# Altium schematic sheet mantarray_beta2_sensor.SchDoc
size A1
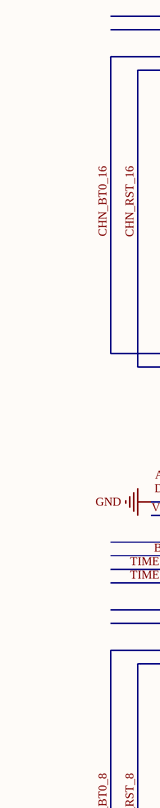
[diagram p0: mantarray_beta2_sensor.SchDoc, top left]
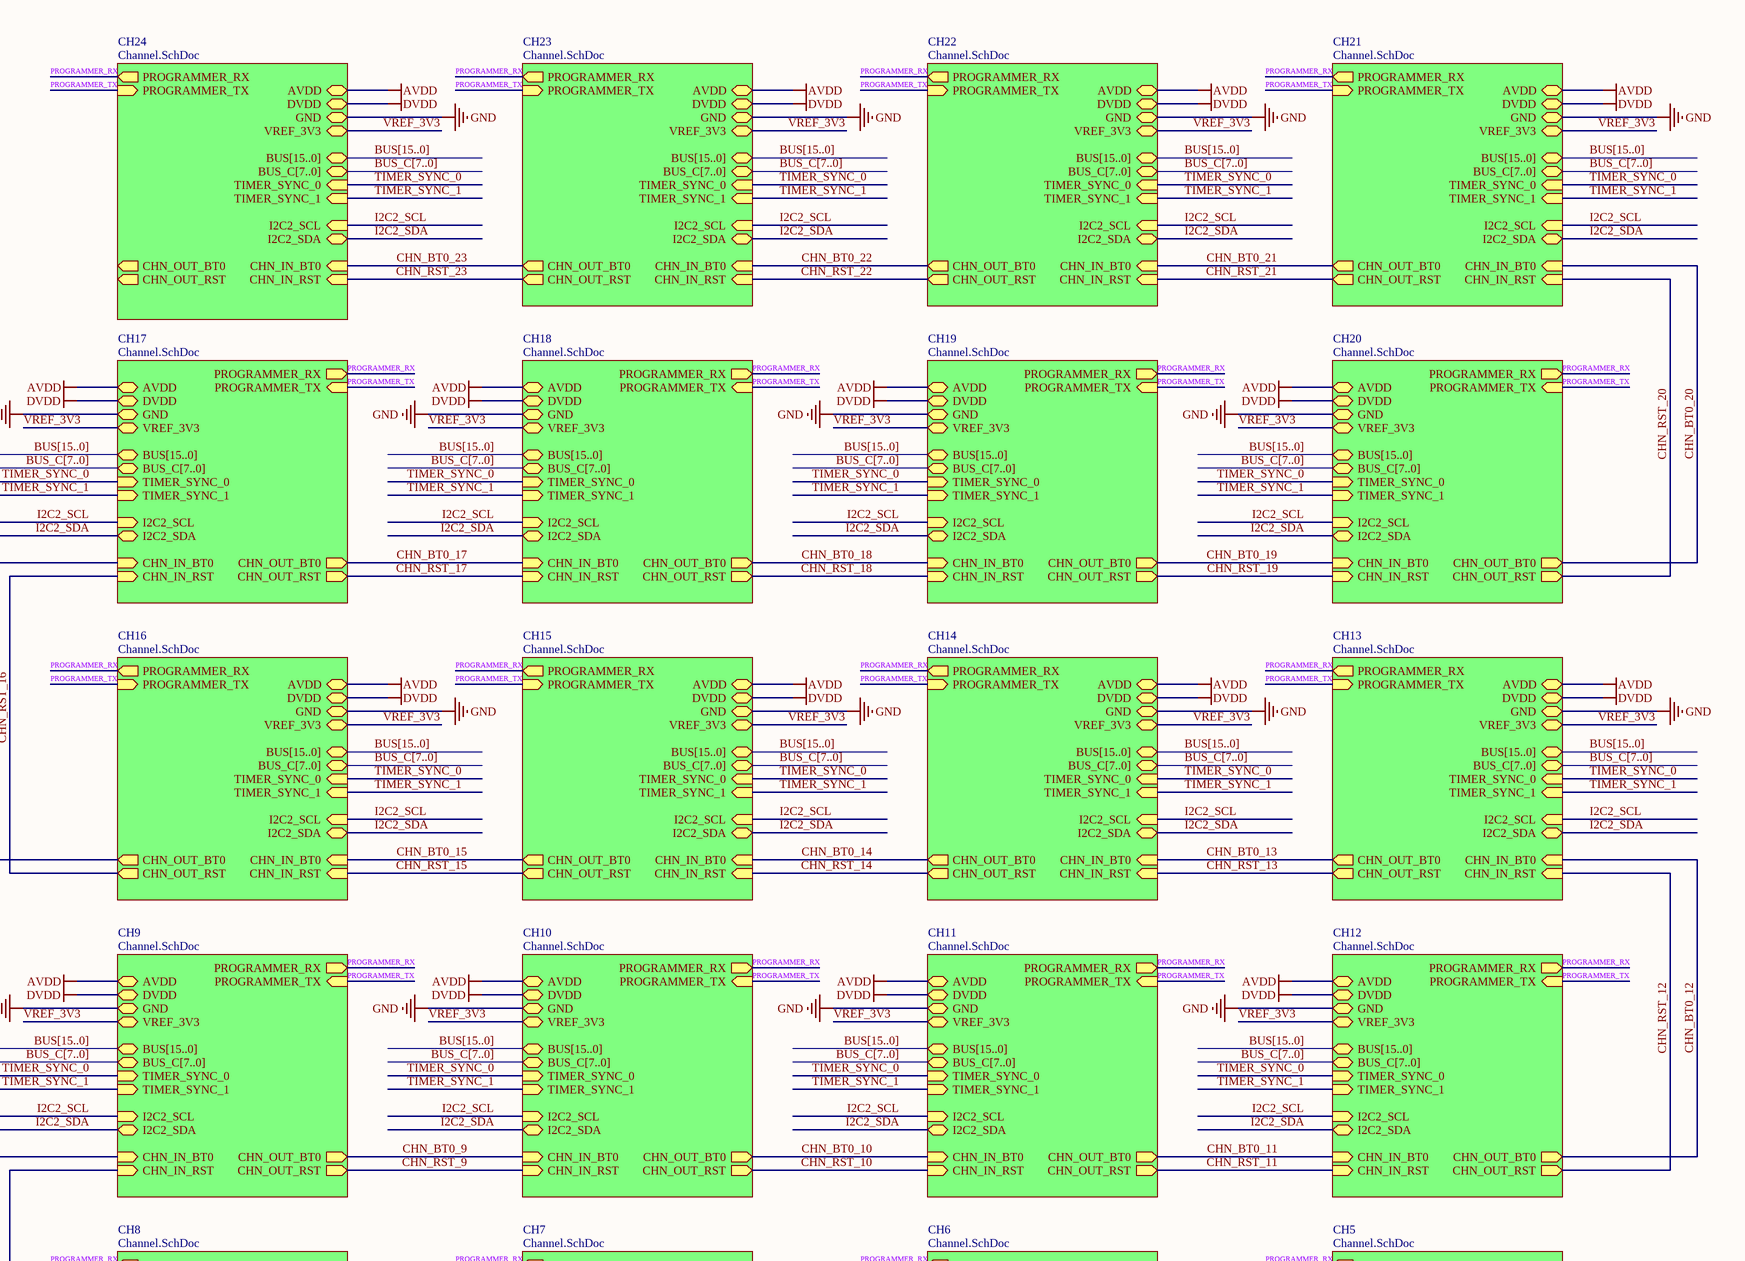
[diagram p1: mantarray_beta2_sensor.SchDoc, top right]
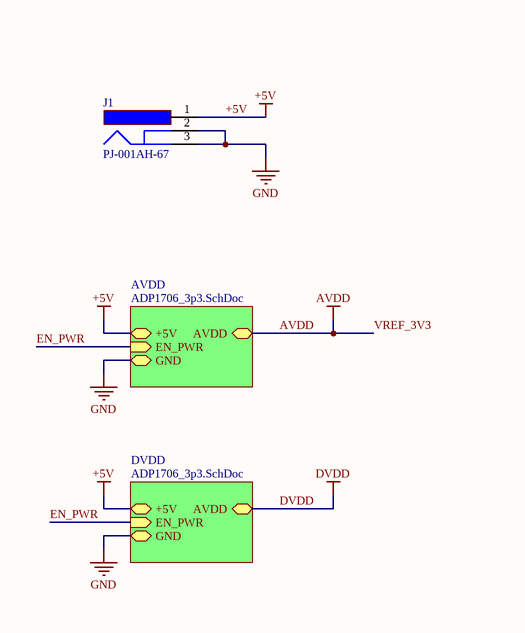
[diagram p2: mantarray_beta2_sensor.SchDoc, bottom left]
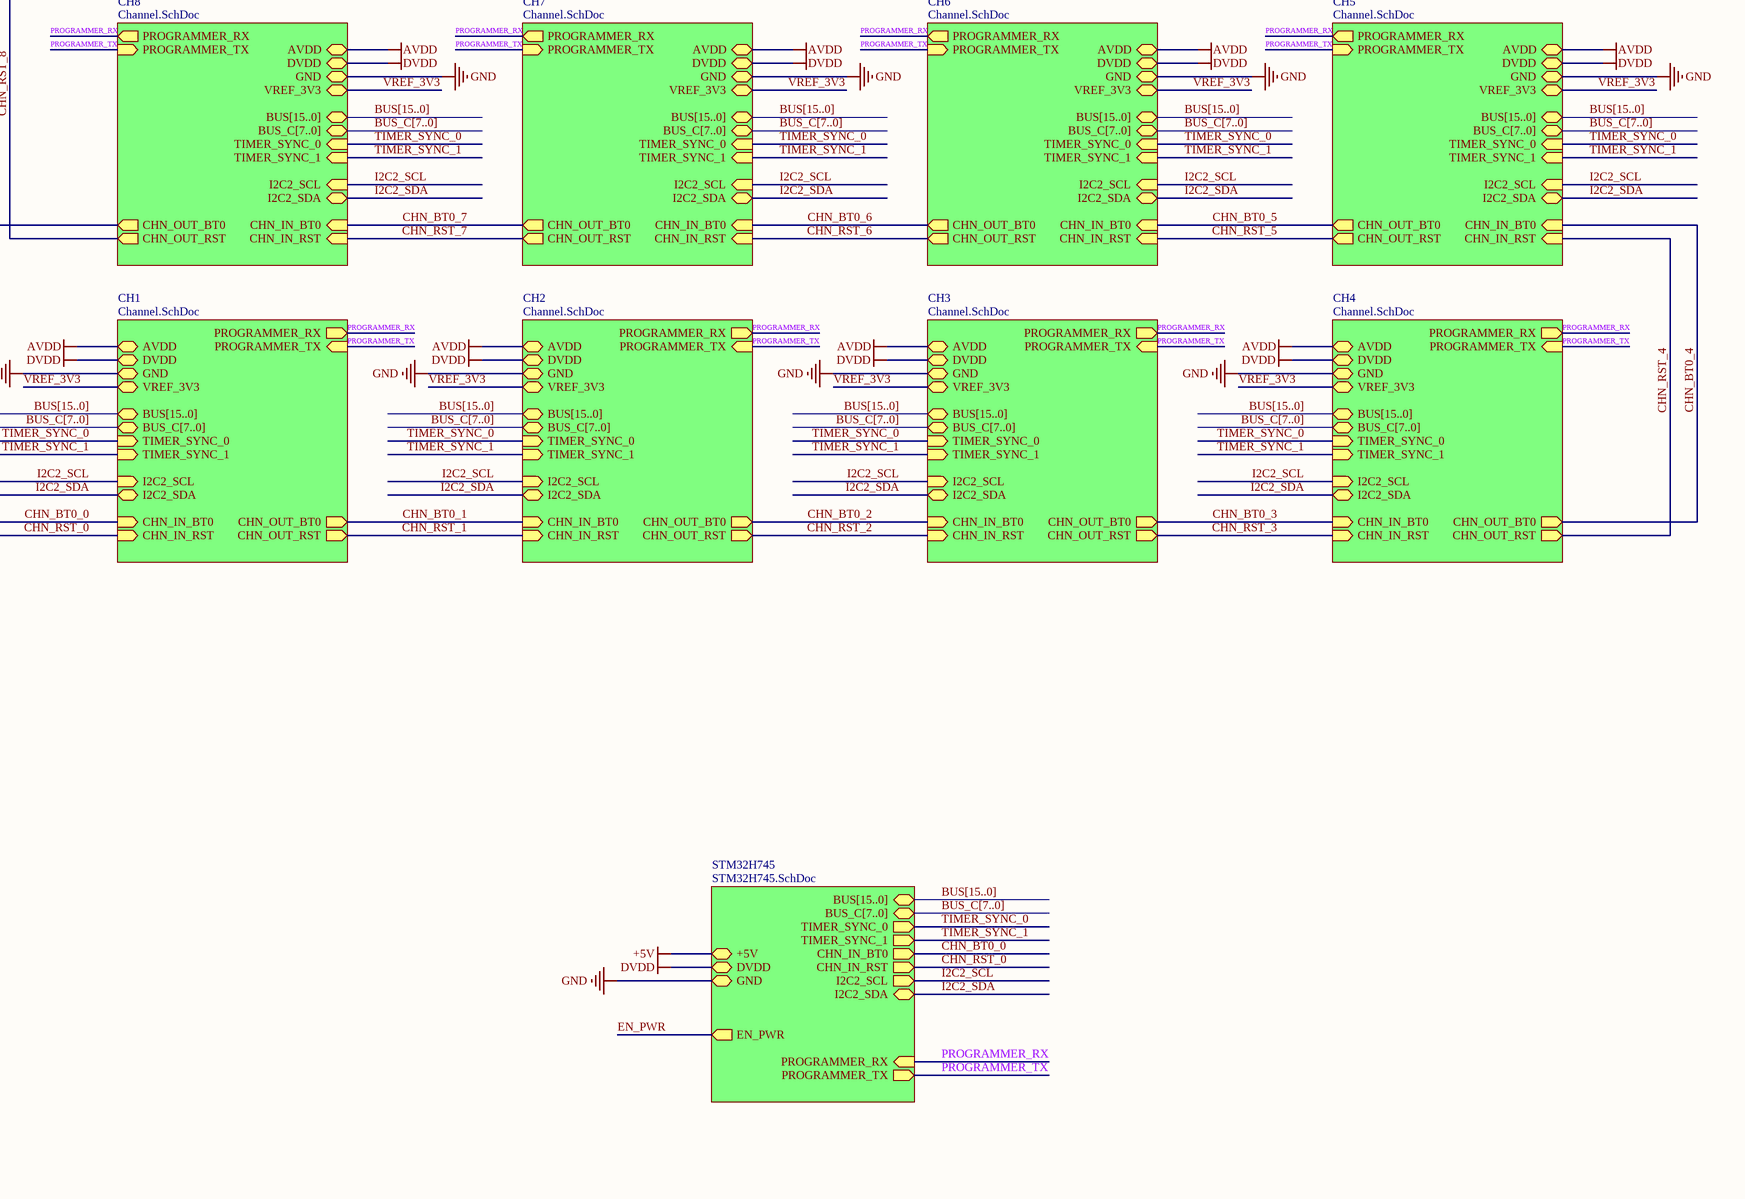
[diagram p3: mantarray_beta2_sensor.SchDoc, bottom right]

## Parts
J1  PJ-001AH-67  [PJ-001AH-67]

## Sub-sheets
AVDD = ADP1706_3p3.SchDoc: GND (bidir), AVDD (bidir), +5V (bidir), EN_PWR (in)
CH1 = Channel.SchDoc: AVDD (bidir), DVDD (bidir), GND (bidir), BUS[15..0] (bidir), CHN_OUT_BT0 (out), CHN_OUT_RST (out), BUS_C[7..0] (bidir), VREF_3V3 (bidir), CHN_IN_RST (in), TIMER_SYNC_0 (in), CHN_IN_BT0 (in), TIMER_SYNC_1 (in), I2C2_SCL (in), I2C2_SDA (bidir), PROGRAMMER_RX (out), PROGRAMMER_TX (in)
CH2 = Channel.SchDoc: AVDD (bidir), DVDD (bidir), GND (bidir), BUS[15..0] (bidir), CHN_OUT_BT0 (out), CHN_OUT_RST (out), BUS_C[7..0] (bidir), VREF_3V3 (bidir), CHN_IN_RST (in), TIMER_SYNC_0 (in), CHN_IN_BT0 (in), TIMER_SYNC_1 (in), I2C2_SCL (in), I2C2_SDA (bidir), PROGRAMMER_RX (out), PROGRAMMER_TX (in)
CH3 = Channel.SchDoc: AVDD (bidir), DVDD (bidir), GND (bidir), BUS[15..0] (bidir), CHN_OUT_BT0 (out), CHN_OUT_RST (out), BUS_C[7..0] (bidir), VREF_3V3 (bidir), CHN_IN_RST (in), TIMER_SYNC_0 (in), CHN_IN_BT0 (in), TIMER_SYNC_1 (in), I2C2_SCL (in), I2C2_SDA (bidir), PROGRAMMER_RX (out), PROGRAMMER_TX (in)
CH4 = Channel.SchDoc: AVDD (bidir), DVDD (bidir), GND (bidir), BUS[15..0] (bidir), CHN_OUT_BT0 (out), CHN_OUT_RST (out), BUS_C[7..0] (bidir), VREF_3V3 (bidir), CHN_IN_RST (in), TIMER_SYNC_0 (in), CHN_IN_BT0 (in), TIMER_SYNC_1 (in), I2C2_SCL (in), I2C2_SDA (bidir), PROGRAMMER_RX (out), PROGRAMMER_TX (in)
CH5 = Channel.SchDoc: AVDD (bidir), DVDD (bidir), GND (bidir), BUS[15..0] (bidir), CHN_OUT_BT0 (out), CHN_OUT_RST (out), BUS_C[7..0] (bidir), VREF_3V3 (bidir), CHN_IN_RST (in), TIMER_SYNC_0 (in), CHN_IN_BT0 (in), TIMER_SYNC_1 (in), I2C2_SCL (in), I2C2_SDA (bidir), PROGRAMMER_TX (in), PROGRAMMER_RX (out)
CH6 = Channel.SchDoc: AVDD (bidir), DVDD (bidir), GND (bidir), BUS[15..0] (bidir), CHN_OUT_BT0 (out), CHN_OUT_RST (out), BUS_C[7..0] (bidir), VREF_3V3 (bidir), CHN_IN_RST (in), TIMER_SYNC_0 (in), CHN_IN_BT0 (in), TIMER_SYNC_1 (in), I2C2_SCL (in), I2C2_SDA (bidir), PROGRAMMER_RX (out), PROGRAMMER_TX (in)
CH7 = Channel.SchDoc: AVDD (bidir), DVDD (bidir), GND (bidir), BUS[15..0] (bidir), CHN_OUT_BT0 (out), CHN_OUT_RST (out), BUS_C[7..0] (bidir), VREF_3V3 (bidir), CHN_IN_RST (in), TIMER_SYNC_0 (in), CHN_IN_BT0 (in), TIMER_SYNC_1 (in), I2C2_SCL (in), I2C2_SDA (bidir), PROGRAMMER_RX (out), PROGRAMMER_TX (in)
CH8 = Channel.SchDoc: AVDD (bidir), DVDD (bidir), GND (bidir), BUS[15..0] (bidir), CHN_OUT_BT0 (out), CHN_OUT_RST (out), BUS_C[7..0] (bidir), VREF_3V3 (bidir), CHN_IN_RST (in), TIMER_SYNC_0 (in), CHN_IN_BT0 (in), TIMER_SYNC_1 (in), I2C2_SCL (in), I2C2_SDA (bidir), PROGRAMMER_RX (out), PROGRAMMER_TX (in)
CH9 = Channel.SchDoc: AVDD (bidir), DVDD (bidir), GND (bidir), BUS[15..0] (bidir), CHN_OUT_BT0 (out), CHN_OUT_RST (out), BUS_C[7..0] (bidir), VREF_3V3 (bidir), CHN_IN_RST (in), TIMER_SYNC_0 (in), CHN_IN_BT0 (in), TIMER_SYNC_1 (in), I2C2_SCL (in), I2C2_SDA (bidir), PROGRAMMER_RX (out), PROGRAMMER_TX (in)
CH10 = Channel.SchDoc: AVDD (bidir), DVDD (bidir), GND (bidir), BUS[15..0] (bidir), CHN_OUT_BT0 (out), CHN_OUT_RST (out), BUS_C[7..0] (bidir), VREF_3V3 (bidir), CHN_IN_RST (in), TIMER_SYNC_0 (in), CHN_IN_BT0 (in), TIMER_SYNC_1 (in), I2C2_SCL (in), I2C2_SDA (bidir), PROGRAMMER_TX (in), PROGRAMMER_RX (out)
CH11 = Channel.SchDoc: AVDD (bidir), DVDD (bidir), GND (bidir), BUS[15..0] (bidir), CHN_OUT_BT0 (out), CHN_OUT_RST (out), BUS_C[7..0] (bidir), VREF_3V3 (bidir), CHN_IN_RST (in), TIMER_SYNC_0 (in), CHN_IN_BT0 (in), TIMER_SYNC_1 (in), I2C2_SCL (in), I2C2_SDA (bidir), PROGRAMMER_RX (out), PROGRAMMER_TX (in)
CH12 = Channel.SchDoc: AVDD (bidir), DVDD (bidir), GND (bidir), BUS[15..0] (bidir), CHN_OUT_BT0 (out), CHN_OUT_RST (out), BUS_C[7..0] (bidir), VREF_3V3 (bidir), CHN_IN_RST (in), TIMER_SYNC_0 (in), CHN_IN_BT0 (in), TIMER_SYNC_1 (in), I2C2_SCL (in), I2C2_SDA (bidir), PROGRAMMER_TX (in), PROGRAMMER_RX (out)
CH13 = Channel.SchDoc: AVDD (bidir), DVDD (bidir), GND (bidir), BUS[15..0] (bidir), CHN_OUT_BT0 (out), CHN_OUT_RST (out), BUS_C[7..0] (bidir), VREF_3V3 (bidir), CHN_IN_RST (in), TIMER_SYNC_0 (in), CHN_IN_BT0 (in), TIMER_SYNC_1 (in), I2C2_SCL (in), I2C2_SDA (bidir), PROGRAMMER_RX (out), PROGRAMMER_TX (in)
CH14 = Channel.SchDoc: AVDD (bidir), DVDD (bidir), GND (bidir), BUS[15..0] (bidir), CHN_OUT_BT0 (out), CHN_OUT_RST (out), BUS_C[7..0] (bidir), VREF_3V3 (bidir), CHN_IN_RST (in), TIMER_SYNC_0 (in), CHN_IN_BT0 (in), TIMER_SYNC_1 (in), I2C2_SCL (in), I2C2_SDA (bidir), PROGRAMMER_RX (out), PROGRAMMER_TX (in)
CH15 = Channel.SchDoc: AVDD (bidir), DVDD (bidir), GND (bidir), BUS[15..0] (bidir), CHN_OUT_BT0 (out), CHN_OUT_RST (out), BUS_C[7..0] (bidir), VREF_3V3 (bidir), CHN_IN_RST (in), TIMER_SYNC_0 (in), CHN_IN_BT0 (in), TIMER_SYNC_1 (in), I2C2_SCL (in), I2C2_SDA (bidir), PROGRAMMER_RX (out), PROGRAMMER_TX (in)
CH16 = Channel.SchDoc: AVDD (bidir), DVDD (bidir), GND (bidir), BUS[15..0] (bidir), CHN_OUT_BT0 (out), CHN_OUT_RST (out), BUS_C[7..0] (bidir), VREF_3V3 (bidir), CHN_IN_RST (in), TIMER_SYNC_0 (in), CHN_IN_BT0 (in), TIMER_SYNC_1 (in), I2C2_SCL (in), I2C2_SDA (bidir), PROGRAMMER_TX (in), PROGRAMMER_RX (out)
CH17 = Channel.SchDoc: AVDD (bidir), DVDD (bidir), GND (bidir), BUS[15..0] (bidir), CHN_OUT_BT0 (out), CHN_OUT_RST (out), BUS_C[7..0] (bidir), VREF_3V3 (bidir), CHN_IN_RST (in), TIMER_SYNC_0 (in), CHN_IN_BT0 (in), TIMER_SYNC_1 (in), I2C2_SCL (in), I2C2_SDA (bidir), PROGRAMMER_TX (in), PROGRAMMER_RX (out)
CH18 = Channel.SchDoc: AVDD (bidir), DVDD (bidir), GND (bidir), BUS[15..0] (bidir), CHN_OUT_BT0 (out), CHN_OUT_RST (out), BUS_C[7..0] (bidir), VREF_3V3 (bidir), CHN_IN_RST (in), TIMER_SYNC_0 (in), CHN_IN_BT0 (in), TIMER_SYNC_1 (in), I2C2_SCL (in), I2C2_SDA (bidir), PROGRAMMER_RX (out), PROGRAMMER_TX (in)
CH19 = Channel.SchDoc: AVDD (bidir), DVDD (bidir), GND (bidir), BUS[15..0] (bidir), CHN_OUT_BT0 (out), CHN_OUT_RST (out), BUS_C[7..0] (bidir), VREF_3V3 (bidir), CHN_IN_RST (in), TIMER_SYNC_0 (in), CHN_IN_BT0 (in), TIMER_SYNC_1 (in), I2C2_SCL (in), I2C2_SDA (bidir), PROGRAMMER_TX (in), PROGRAMMER_RX (out)
CH20 = Channel.SchDoc: AVDD (bidir), DVDD (bidir), GND (bidir), BUS[15..0] (bidir), CHN_OUT_BT0 (out), CHN_OUT_RST (out), BUS_C[7..0] (bidir), VREF_3V3 (bidir), CHN_IN_RST (in), TIMER_SYNC_0 (in), CHN_IN_BT0 (in), TIMER_SYNC_1 (in), I2C2_SCL (in), I2C2_SDA (bidir), PROGRAMMER_RX (out), PROGRAMMER_TX (in)
CH21 = Channel.SchDoc: AVDD (bidir), DVDD (bidir), GND (bidir), BUS[15..0] (bidir), CHN_OUT_BT0 (out), CHN_OUT_RST (out), BUS_C[7..0] (bidir), VREF_3V3 (bidir), CHN_IN_RST (in), TIMER_SYNC_0 (in), CHN_IN_BT0 (in), TIMER_SYNC_1 (in), I2C2_SCL (in), I2C2_SDA (bidir), PROGRAMMER_TX (in), PROGRAMMER_RX (out)
CH22 = Channel.SchDoc: AVDD (bidir), DVDD (bidir), GND (bidir), BUS[15..0] (bidir), CHN_OUT_BT0 (out), CHN_OUT_RST (out), BUS_C[7..0] (bidir), VREF_3V3 (bidir), CHN_IN_RST (in), TIMER_SYNC_0 (in), CHN_IN_BT0 (in), TIMER_SYNC_1 (in), I2C2_SCL (in), I2C2_SDA (bidir), PROGRAMMER_TX (in), PROGRAMMER_RX (out)
CH23 = Channel.SchDoc: AVDD (bidir), DVDD (bidir), GND (bidir), BUS[15..0] (bidir), CHN_OUT_BT0 (out), CHN_OUT_RST (out), BUS_C[7..0] (bidir), VREF_3V3 (bidir), CHN_IN_RST (in), TIMER_SYNC_0 (in), CHN_IN_BT0 (in), TIMER_SYNC_1 (in), I2C2_SCL (in), I2C2_SDA (bidir), PROGRAMMER_RX (out), PROGRAMMER_TX (in)
CH24 = Channel.SchDoc: AVDD (bidir), DVDD (bidir), GND (bidir), BUS[15..0] (bidir), CHN_OUT_BT0 (out), CHN_OUT_RST (out), BUS_C[7..0] (bidir), VREF_3V3 (bidir), CHN_IN_RST (in), TIMER_SYNC_0 (in), CHN_IN_BT0 (in), TIMER_SYNC_1 (in), I2C2_SCL (in), I2C2_SDA (bidir), PROGRAMMER_RX (out), PROGRAMMER_TX (in)
DVDD = ADP1706_3p3.SchDoc: GND (bidir), AVDD (bidir), +5V (bidir), EN_PWR (in)
STM32H745 = STM32H745.SchDoc: GND (bidir), DVDD (bidir), +5V (bidir), BUS[15..0] (bidir), BUS_C[7..0] (bidir), TIMER_SYNC_0 (out), I2C2_SDA (bidir), I2C2_SCL (out), TIMER_SYNC_1 (out), CHN_IN_BT0 (out), CHN_IN_RST (out), PROGRAMMER_RX (in), PROGRAMMER_TX (out), EN_PWR (out)

## Nets
+5V: J1.1 ; sheet AVDD/+5V, sheet DVDD/+5V, sheet STM32H745/+5V
AVDD: sheet AVDD/AVDD, sheet CH1/AVDD, sheet CH1/VREF_3V3, sheet CH2/AVDD, sheet CH2/VREF_3V3, sheet CH3/AVDD, sheet CH3/VREF_3V3, sheet CH4/AVDD, sheet CH4/VREF_3V3, sheet CH5/AVDD, sheet CH5/VREF_3V3, sheet CH6/AVDD, sheet CH6/VREF_3V3, sheet CH7/AVDD, sheet CH7/VREF_3V3, sheet CH8/AVDD, sheet CH8/VREF_3V3, sheet CH9/AVDD, sheet CH9/VREF_3V3, sheet CH10/AVDD, sheet CH10/VREF_3V3, sheet CH11/AVDD, sheet CH11/VREF_3V3, sheet CH12/AVDD, sheet CH12/VREF_3V3, sheet CH13/AVDD, sheet CH13/VREF_3V3, sheet CH14/AVDD, sheet CH14/VREF_3V3, sheet CH15/AVDD, sheet CH15/VREF_3V3, sheet CH16/AVDD, sheet CH16/VREF_3V3, sheet CH17/AVDD, sheet CH17/VREF_3V3, sheet CH18/AVDD, sheet CH18/VREF_3V3, sheet CH19/AVDD, sheet CH19/VREF_3V3, sheet CH20/AVDD, sheet CH20/VREF_3V3, sheet CH21/AVDD, sheet CH21/VREF_3V3, sheet CH22/AVDD, sheet CH22/VREF_3V3, sheet CH23/AVDD, sheet CH23/VREF_3V3, sheet CH24/AVDD, sheet CH24/VREF_3V3  [also labelled VREF_3V3]
DVDD: sheet DVDD/AVDD, sheet STM32H745/DVDD, sheet CH1/DVDD, sheet CH2/DVDD, sheet CH3/DVDD, sheet CH4/DVDD, sheet CH5/DVDD, sheet CH6/DVDD, sheet CH7/DVDD, sheet CH8/DVDD, sheet CH9/DVDD, sheet CH10/DVDD, sheet CH11/DVDD, sheet CH12/DVDD, sheet CH13/DVDD, sheet CH14/DVDD, sheet CH15/DVDD, sheet CH16/DVDD, sheet CH17/DVDD, sheet CH18/DVDD, sheet CH19/DVDD, sheet CH20/DVDD, sheet CH21/DVDD, sheet CH22/DVDD, sheet CH23/DVDD, sheet CH24/DVDD
GND: J1.2 J1.3 ; sheet AVDD/GND, sheet DVDD/GND, sheet STM32H745/GND, sheet CH1/GND, sheet CH2/GND, sheet CH3/GND, sheet CH4/GND, sheet CH5/GND, sheet CH6/GND, sheet CH7/GND, sheet CH8/GND, sheet CH9/GND, sheet CH10/GND, sheet CH11/GND, sheet CH12/GND, sheet CH13/GND, sheet CH14/GND, sheet CH15/GND, sheet CH16/GND, sheet CH17/GND, sheet CH18/GND, sheet CH19/GND, sheet CH20/GND, sheet CH21/GND, sheet CH22/GND, sheet CH23/GND, sheet CH24/GND
CHN_BT0_0: sheet STM32H745/CHN_IN_BT0, sheet CH1/CHN_IN_BT0
CHN_BT0_1: sheet CH1/CHN_OUT_BT0, sheet CH2/CHN_IN_BT0
CHN_BT0_2: sheet CH2/CHN_OUT_BT0, sheet CH3/CHN_IN_BT0
CHN_BT0_3: sheet CH3/CHN_OUT_BT0, sheet CH4/CHN_IN_BT0
CHN_BT0_4: sheet CH4/CHN_OUT_BT0, sheet CH5/CHN_IN_BT0
CHN_BT0_5: sheet CH5/CHN_OUT_BT0, sheet CH6/CHN_IN_BT0
CHN_BT0_6: sheet CH6/CHN_OUT_BT0, sheet CH7/CHN_IN_BT0
CHN_BT0_7: sheet CH7/CHN_OUT_BT0, sheet CH8/CHN_IN_BT0
CHN_BT0_8: sheet CH8/CHN_OUT_BT0, sheet CH9/CHN_IN_BT0
CHN_BT0_9: sheet CH9/CHN_OUT_BT0, sheet CH10/CHN_IN_BT0
CHN_BT0_10: sheet CH10/CHN_OUT_BT0, sheet CH11/CHN_IN_BT0
CHN_BT0_11: sheet CH11/CHN_OUT_BT0, sheet CH12/CHN_IN_BT0
CHN_BT0_12: sheet CH12/CHN_OUT_BT0, sheet CH13/CHN_IN_BT0
CHN_BT0_13: sheet CH13/CHN_OUT_BT0, sheet CH14/CHN_IN_BT0
CHN_BT0_14: sheet CH14/CHN_OUT_BT0, sheet CH15/CHN_IN_BT0
CHN_BT0_15: sheet CH15/CHN_OUT_BT0, sheet CH16/CHN_IN_BT0
CHN_BT0_16: sheet CH16/CHN_OUT_BT0, sheet CH17/CHN_IN_BT0
CHN_BT0_17: sheet CH17/CHN_OUT_BT0, sheet CH18/CHN_IN_BT0
CHN_BT0_18: sheet CH18/CHN_OUT_BT0, sheet CH19/CHN_IN_BT0
CHN_BT0_19: sheet CH19/CHN_OUT_BT0, sheet CH20/CHN_IN_BT0
CHN_BT0_20: sheet CH20/CHN_OUT_BT0, sheet CH21/CHN_IN_BT0
CHN_BT0_21: sheet CH21/CHN_OUT_BT0, sheet CH22/CHN_IN_BT0
CHN_BT0_22: sheet CH22/CHN_OUT_BT0, sheet CH23/CHN_IN_BT0
CHN_BT0_23: sheet CH23/CHN_OUT_BT0, sheet CH24/CHN_IN_BT0
CHN_RST_0: sheet STM32H745/CHN_IN_RST, sheet CH1/CHN_IN_RST
CHN_RST_1: sheet CH1/CHN_OUT_RST, sheet CH2/CHN_IN_RST
CHN_RST_2: sheet CH2/CHN_OUT_RST, sheet CH3/CHN_IN_RST
CHN_RST_3: sheet CH3/CHN_OUT_RST, sheet CH4/CHN_IN_RST
CHN_RST_4: sheet CH4/CHN_OUT_RST, sheet CH5/CHN_IN_RST
CHN_RST_5: sheet CH5/CHN_OUT_RST, sheet CH6/CHN_IN_RST
CHN_RST_6: sheet CH6/CHN_OUT_RST, sheet CH7/CHN_IN_RST
CHN_RST_7: sheet CH7/CHN_OUT_RST, sheet CH8/CHN_IN_RST
CHN_RST_8: sheet CH8/CHN_OUT_RST, sheet CH9/CHN_IN_RST
CHN_RST_9: sheet CH9/CHN_OUT_RST, sheet CH10/CHN_IN_RST
CHN_RST_10: sheet CH10/CHN_OUT_RST, sheet CH11/CHN_IN_RST
CHN_RST_11: sheet CH11/CHN_OUT_RST, sheet CH12/CHN_IN_RST
CHN_RST_12: sheet CH12/CHN_OUT_RST, sheet CH13/CHN_IN_RST
CHN_RST_13: sheet CH13/CHN_OUT_RST, sheet CH14/CHN_IN_RST
CHN_RST_14: sheet CH14/CHN_OUT_RST, sheet CH15/CHN_IN_RST
CHN_RST_15: sheet CH15/CHN_OUT_RST, sheet CH16/CHN_IN_RST
CHN_RST_16: sheet CH16/CHN_OUT_RST, sheet CH17/CHN_IN_RST
CHN_RST_17: sheet CH17/CHN_OUT_RST, sheet CH18/CHN_IN_RST
CHN_RST_18: sheet CH18/CHN_OUT_RST, sheet CH19/CHN_IN_RST
CHN_RST_19: sheet CH19/CHN_OUT_RST, sheet CH20/CHN_IN_RST
CHN_RST_20: sheet CH20/CHN_OUT_RST, sheet CH21/CHN_IN_RST
CHN_RST_21: sheet CH21/CHN_OUT_RST, sheet CH22/CHN_IN_RST
CHN_RST_22: sheet CH22/CHN_OUT_RST, sheet CH23/CHN_IN_RST
CHN_RST_23: sheet CH23/CHN_OUT_RST, sheet CH24/CHN_IN_RST
EN_PWR: sheet AVDD/EN_PWR, sheet DVDD/EN_PWR, sheet STM32H745/EN_PWR
I2C2_SCL: sheet STM32H745/I2C2_SCL, sheet CH1/I2C2_SCL, sheet CH2/I2C2_SCL, sheet CH3/I2C2_SCL, sheet CH4/I2C2_SCL, sheet CH5/I2C2_SCL, sheet CH6/I2C2_SCL, sheet CH7/I2C2_SCL, sheet CH8/I2C2_SCL, sheet CH9/I2C2_SCL, sheet CH10/I2C2_SCL, sheet CH11/I2C2_SCL, sheet CH12/I2C2_SCL, sheet CH13/I2C2_SCL, sheet CH14/I2C2_SCL, sheet CH15/I2C2_SCL, sheet CH16/I2C2_SCL, sheet CH17/I2C2_SCL, sheet CH18/I2C2_SCL, sheet CH19/I2C2_SCL, sheet CH20/I2C2_SCL, sheet CH21/I2C2_SCL, sheet CH22/I2C2_SCL, sheet CH23/I2C2_SCL, sheet CH24/I2C2_SCL
I2C2_SDA: sheet STM32H745/I2C2_SDA, sheet CH1/I2C2_SDA, sheet CH2/I2C2_SDA, sheet CH3/I2C2_SDA, sheet CH4/I2C2_SDA, sheet CH5/I2C2_SDA, sheet CH6/I2C2_SDA, sheet CH7/I2C2_SDA, sheet CH8/I2C2_SDA, sheet CH9/I2C2_SDA, sheet CH10/I2C2_SDA, sheet CH11/I2C2_SDA, sheet CH12/I2C2_SDA, sheet CH13/I2C2_SDA, sheet CH14/I2C2_SDA, sheet CH15/I2C2_SDA, sheet CH16/I2C2_SDA, sheet CH17/I2C2_SDA, sheet CH18/I2C2_SDA, sheet CH19/I2C2_SDA, sheet CH20/I2C2_SDA, sheet CH21/I2C2_SDA, sheet CH22/I2C2_SDA, sheet CH23/I2C2_SDA, sheet CH24/I2C2_SDA
PROGRAMMER_RX: sheet STM32H745/PROGRAMMER_RX, sheet CH1/PROGRAMMER_RX, sheet CH2/PROGRAMMER_RX, sheet CH3/PROGRAMMER_RX, sheet CH4/PROGRAMMER_RX, sheet CH5/PROGRAMMER_RX, sheet CH6/PROGRAMMER_RX, sheet CH7/PROGRAMMER_RX, sheet CH8/PROGRAMMER_RX, sheet CH9/PROGRAMMER_RX, sheet CH10/PROGRAMMER_RX, sheet CH11/PROGRAMMER_RX, sheet CH12/PROGRAMMER_RX, sheet CH13/PROGRAMMER_RX, sheet CH14/PROGRAMMER_RX, sheet CH15/PROGRAMMER_RX, sheet CH16/PROGRAMMER_RX, sheet CH17/PROGRAMMER_RX, sheet CH18/PROGRAMMER_RX, sheet CH19/PROGRAMMER_RX, sheet CH20/PROGRAMMER_RX, sheet CH21/PROGRAMMER_RX, sheet CH22/PROGRAMMER_RX, sheet CH23/PROGRAMMER_RX, sheet CH24/PROGRAMMER_RX
PROGRAMMER_TX: sheet STM32H745/PROGRAMMER_TX, sheet CH1/PROGRAMMER_TX, sheet CH2/PROGRAMMER_TX, sheet CH3/PROGRAMMER_TX, sheet CH4/PROGRAMMER_TX, sheet CH5/PROGRAMMER_TX, sheet CH6/PROGRAMMER_TX, sheet CH7/PROGRAMMER_TX, sheet CH8/PROGRAMMER_TX, sheet CH9/PROGRAMMER_TX, sheet CH10/PROGRAMMER_TX, sheet CH11/PROGRAMMER_TX, sheet CH12/PROGRAMMER_TX, sheet CH13/PROGRAMMER_TX, sheet CH14/PROGRAMMER_TX, sheet CH15/PROGRAMMER_TX, sheet CH16/PROGRAMMER_TX, sheet CH17/PROGRAMMER_TX, sheet CH18/PROGRAMMER_TX, sheet CH19/PROGRAMMER_TX, sheet CH20/PROGRAMMER_TX, sheet CH21/PROGRAMMER_TX, sheet CH22/PROGRAMMER_TX, sheet CH23/PROGRAMMER_TX, sheet CH24/PROGRAMMER_TX
TIMER_SYNC_0: sheet STM32H745/TIMER_SYNC_0, sheet CH1/TIMER_SYNC_0, sheet CH2/TIMER_SYNC_0, sheet CH3/TIMER_SYNC_0, sheet CH4/TIMER_SYNC_0, sheet CH5/TIMER_SYNC_0, sheet CH6/TIMER_SYNC_0, sheet CH7/TIMER_SYNC_0, sheet CH8/TIMER_SYNC_0, sheet CH9/TIMER_SYNC_0, sheet CH10/TIMER_SYNC_0, sheet CH11/TIMER_SYNC_0, sheet CH12/TIMER_SYNC_0, sheet CH13/TIMER_SYNC_0, sheet CH14/TIMER_SYNC_0, sheet CH15/TIMER_SYNC_0, sheet CH16/TIMER_SYNC_0, sheet CH17/TIMER_SYNC_0, sheet CH18/TIMER_SYNC_0, sheet CH19/TIMER_SYNC_0, sheet CH20/TIMER_SYNC_0, sheet CH21/TIMER_SYNC_0, sheet CH22/TIMER_SYNC_0, sheet CH23/TIMER_SYNC_0, sheet CH24/TIMER_SYNC_0
TIMER_SYNC_1: sheet STM32H745/TIMER_SYNC_1, sheet CH1/TIMER_SYNC_1, sheet CH2/TIMER_SYNC_1, sheet CH3/TIMER_SYNC_1, sheet CH4/TIMER_SYNC_1, sheet CH5/TIMER_SYNC_1, sheet CH6/TIMER_SYNC_1, sheet CH7/TIMER_SYNC_1, sheet CH8/TIMER_SYNC_1, sheet CH9/TIMER_SYNC_1, sheet CH10/TIMER_SYNC_1, sheet CH11/TIMER_SYNC_1, sheet CH12/TIMER_SYNC_1, sheet CH13/TIMER_SYNC_1, sheet CH14/TIMER_SYNC_1, sheet CH15/TIMER_SYNC_1, sheet CH16/TIMER_SYNC_1, sheet CH17/TIMER_SYNC_1, sheet CH18/TIMER_SYNC_1, sheet CH19/TIMER_SYNC_1, sheet CH20/TIMER_SYNC_1, sheet CH21/TIMER_SYNC_1, sheet CH22/TIMER_SYNC_1, sheet CH23/TIMER_SYNC_1, sheet CH24/TIMER_SYNC_1

## Buses and harness runs
bus BUS[15..0] = sheet CH1/BUS[15..0]
bus BUS[15..0] = sheet CH2/BUS[15..0]
bus BUS[15..0] = sheet CH3/BUS[15..0]
bus BUS[15..0] = sheet CH4/BUS[15..0]
bus BUS[15..0] = sheet CH5/BUS[15..0]
bus BUS[15..0] = sheet CH6/BUS[15..0]
bus BUS[15..0] = sheet CH7/BUS[15..0]
bus BUS[15..0] = sheet CH8/BUS[15..0]
bus BUS[15..0] = sheet CH9/BUS[15..0]
bus BUS[15..0] = sheet CH10/BUS[15..0]
bus BUS[15..0] = sheet CH11/BUS[15..0]
bus BUS[15..0] = sheet CH12/BUS[15..0]
bus BUS[15..0] = sheet CH13/BUS[15..0]
bus BUS[15..0] = sheet CH14/BUS[15..0]
bus BUS[15..0] = sheet CH15/BUS[15..0]
bus BUS[15..0] = sheet CH16/BUS[15..0]
bus BUS[15..0] = sheet CH17/BUS[15..0]
bus BUS[15..0] = sheet CH18/BUS[15..0]
bus BUS[15..0] = sheet CH19/BUS[15..0]
bus BUS[15..0] = sheet CH20/BUS[15..0]
bus BUS[15..0] = sheet CH21/BUS[15..0]
bus BUS[15..0] = sheet CH22/BUS[15..0]
bus BUS[15..0] = sheet CH23/BUS[15..0]
bus BUS[15..0] = sheet CH24/BUS[15..0]
bus BUS[15..0] = sheet STM32H745/BUS[15..0]
bus BUS_C[7..0] = sheet CH1/BUS_C[7..0]
bus BUS_C[7..0] = sheet CH2/BUS_C[7..0]
bus BUS_C[7..0] = sheet CH3/BUS_C[7..0]
bus BUS_C[7..0] = sheet CH4/BUS_C[7..0]
bus BUS_C[7..0] = sheet CH5/BUS_C[7..0]
bus BUS_C[7..0] = sheet CH6/BUS_C[7..0]
bus BUS_C[7..0] = sheet CH7/BUS_C[7..0]
bus BUS_C[7..0] = sheet CH8/BUS_C[7..0]
bus BUS_C[7..0] = sheet CH9/BUS_C[7..0]
bus BUS_C[7..0] = sheet CH10/BUS_C[7..0]
bus BUS_C[7..0] = sheet CH11/BUS_C[7..0]
bus BUS_C[7..0] = sheet CH12/BUS_C[7..0]
bus BUS_C[7..0] = sheet CH13/BUS_C[7..0]
bus BUS_C[7..0] = sheet CH14/BUS_C[7..0]
bus BUS_C[7..0] = sheet CH15/BUS_C[7..0]
bus BUS_C[7..0] = sheet CH16/BUS_C[7..0]
bus BUS_C[7..0] = sheet CH17/BUS_C[7..0]
bus BUS_C[7..0] = sheet CH18/BUS_C[7..0]
bus BUS_C[7..0] = sheet CH19/BUS_C[7..0]
bus BUS_C[7..0] = sheet CH20/BUS_C[7..0]
bus BUS_C[7..0] = sheet CH21/BUS_C[7..0]
bus BUS_C[7..0] = sheet CH22/BUS_C[7..0]
bus BUS_C[7..0] = sheet CH23/BUS_C[7..0]
bus BUS_C[7..0] = sheet CH24/BUS_C[7..0]
bus BUS_C[7..0] = sheet STM32H745/BUS_C[7..0]

## Notes on the sheet
- Title
- Size:
- Date:
- File:
- A1
- Number:
- Time:
- Revision:
- Sheet
- of

## Library data of the parts
J1 = PJ-001AH-67: IP67 waterproof DC Power Jack; Digikey: https://www.digikey.com/en/products/detail/cui-devices/PJ-001AH-67/9866231?s=N4IgTCBcDaIAoCkC0AGFBGAggCSQNgHYQBdAXyA